# Altium schematic sheet Sheet1.SchDoc
size A4
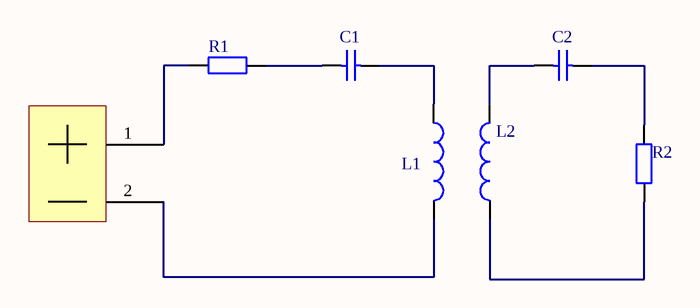
[diagram p0: Sheet1.SchDoc]

## Parts
BAT?  BAT  [BHDR2_1.87]  (value not drawn)
C1  Cap semi  [C0402]  (value not drawn)
C2  Cap semi  [C0402]  (value not drawn)
L1  Inductor  [L0805]  (value not drawn)
L2  Inductor  [L0805]  (value not drawn)
R1  Res2  [R0402]  (value not drawn)
R2  Res2  [R0402]  (value not drawn)

## Nets
NetBAT?_1: BAT?.1(+) R1.1
NetBAT?_2: BAT?.2(-) L1.2
NetC1_1: C1.1 L1.1
NetC1_2: C1.2 R1.2
NetC2_1: C2.1 R2.1
NetC2_2: C2.2 L2.2
NetL2_1: L2.1 R2.2

## Library data of the parts
BAT? = BAT_CN
C1 C2 = Cap semi: Capacitor (Semiconductor SIM Model); Value: 0.1uF; Published: 8-Jun-2000; LatestRevisionDate: 29-May-2009; LatestRevisionNote: IPC-7351 Footprint Added.; PackageReference: C1206; Publisher: Altium Limited; PackageDescription: Chip Capacitor
L1 L2 = Inductor: Code_IEC: 1005; Value: 2.2uH; Published: 8-Jun-2000; LatestRevisionDate: 29-May-2009; LatestRevisionNote: IPC-7351 Footprint Added.; PackageReference: 0402-A; Publisher: Altium Limited; PackageDescription: Chip Inductor; Code_JEITA: 0402
R1 R2 = Res2: Resistor; Value: 1M; Published: 8-Jun-2000; LatestRevisionDate: 17-Jul-2002; LatestRevisionNote: Re-released for DXP Platform.; PackageReference: AXIAL-0.4; Publisher: Altium Limited